# Altium schematic sheet connectors.SchDoc
size 431 x 279 mm; SheetNumber: 2; SheetTotal: 4
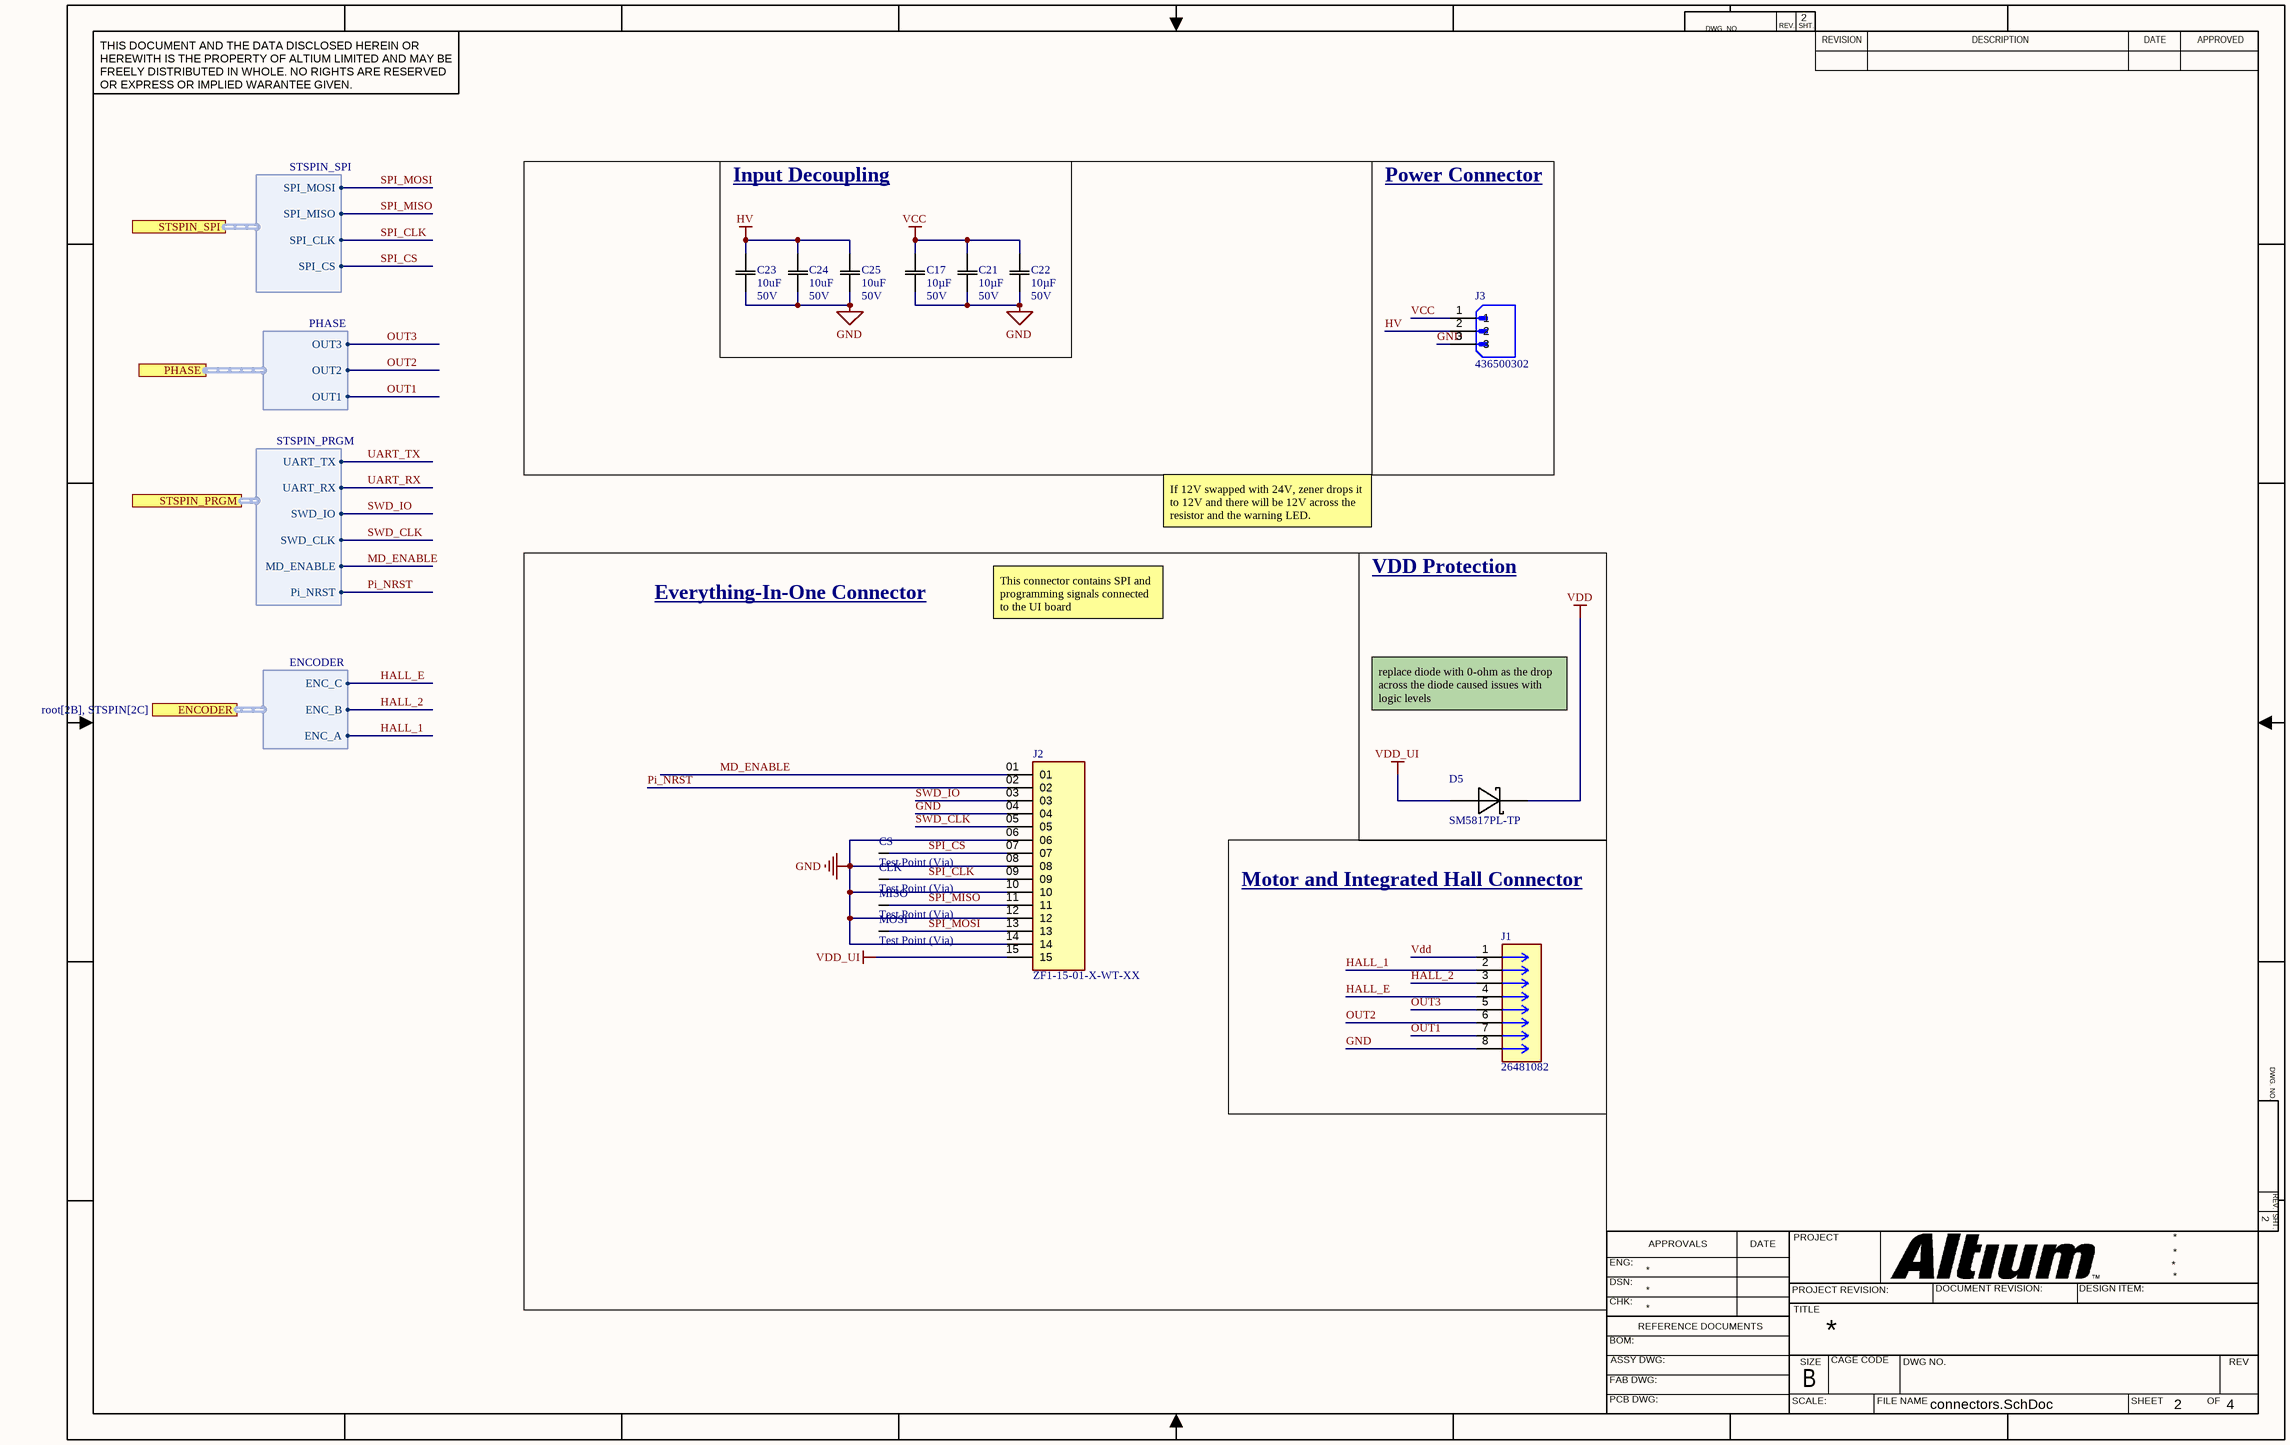
[diagram p0: connectors.SchDoc]

## Parts
C17  value 10µF  Rating: 50V  [0805]  (hidden comment: CAP 10uF 50V)
C21  value 10µF  Rating: 50V  [0805]  (hidden comment: CAP 10uF 50V)
C22  value 10µF  Rating: 50V  [0805]  (hidden comment: CAP 10uF 50V)
C23  Rating: 50V  [0805]  (hidden comment: 10uF)
C24  Rating: 50V  [0805]  (hidden comment: 10uF)
C25  Rating: 50V  [0805]  (hidden comment: 10uF)
CLK  Test Point (Via)  [TP]  (no BOM)
CS  Test Point (Via)  [TP]  (no BOM)
D5  SM5817PL-TP  [SOD-123]
J1  26481082  [CONN_A-41662-B08A_MOL]
J2  ZF1-15-01-X-WT-XX  [SAMTEC_ZF1-15-01-X-WT-XX]
J3  436500302  [MOLEX_436500302]
MISO  Test Point (Via)  [TP]  (no BOM)
MOSI  Test Point (Via)  [TP]  (no BOM)

## Blocks framed on the sheet
Input Decoupling: C17 C21-C25
Power Connector: J3
Everything-In-One Connector: CLK CS J2 MISO MOSI
VDD Protection: D5
Motor and Integrated Hall Connector: J1

## Ports
ENCODER (harness ENCODER, see root[2B], STSPIN[2C]), PHASE (harness PHASE, see root[2B], STSPIN[2D]), STSPIN_PRGM (harness STSPIN_PRGM, see root[2B], STSPIN[2D]), STSPIN_SPI (harness STSPIN_SPI, see root[2B], STSPIN[2E])

## Harnesses
PHASE: OUT3, OUT2, OUT1
ENCODER: ENC_C, ENC_B, ENC_A
STSPIN_SPI: SPI_MOSI, SPI_MISO, SPI_CLK, SPI_CS
STSPIN_PRGM: SWD_IO, SWD_CLK, UART_TX, UART_RX, MD_ENABLE, Pi_NRST

## Nets
GND: C17.1(C1) C21.1(C1) C22.1(C1) C23.1(C1) C24.1(C1) C25.1(C1) J1.8 J2.04 J2.06 J2.08 J2.10 J2.12 J2.14 J3.3
HV: C23.2(C2) C24.2(C2) C25.2(C2) J3.2
VCC: C17.2(C2) C21.2(C2) C22.2(C2) J3.1
Vdd: D5.C(K) J1.1
VDD_UI: D5.A J2.15
HALL_1: J1.2 ; port ENCODER.ENC_A
HALL_2: J1.3 ; port ENCODER.ENC_B
HALL_E: J1.4 ; port ENCODER.ENC_C
MD_ENABLE: J2.01 ; port STSPIN_PRGM.MD_ENABLE
OUT1: J1.7 ; port PHASE.OUT1
OUT2: J1.6 ; port PHASE.OUT2
OUT3: J1.5 ; port PHASE.OUT3
Pi_NRST: J2.02 ; port STSPIN_PRGM.Pi_NRST
SPI_CLK: CLK.1 J2.09 ; port STSPIN_SPI.SPI_CLK
SPI_CS: CS.1 J2.07 ; port STSPIN_SPI.SPI_CS
SPI_MISO: J2.11 MISO.1 ; port STSPIN_SPI.SPI_MISO
SPI_MOSI: J2.13 MOSI.1 ; port STSPIN_SPI.SPI_MOSI
SWD_CLK: J2.05 ; port STSPIN_PRGM.SWD_CLK
SWD_IO: J2.03 ; port STSPIN_PRGM.SWD_IO
UART_RX: port STSPIN_PRGM.UART_RX
UART_TX: port STSPIN_PRGM.UART_TX

## Notes on the sheet
- If 12V swapped with 24V, zener drops it to 12V and there will be 12V across the resistor and the warning LED.
- This connector contains SPI and programming signals connected to the UI board
- replace diode with 0-ohm as the drop across the diode caused issues with logic levels
- DWG. NO.
- REV.
- SHT.
- THIS DOCUMENT AND THE DATA DISCLOSED HEREIN OR HEREWITH IS THE PROPERTY OF ALTIUM LIMITED AND MAY BE FREELY DISTRIBUTED IN WHOLE. NO RIGHTS ARE RESERVED OR EXPRESS OR IMPLIED WARANTEE GIVEN.
- REVISION
- DESCRIPTION
- DATE
- APPROVED
- ENG:
- APPROVALS
- PROJECT
- DSN:
- CHK:
- REFERENCE DOCUMENTS
- PROJECT REVISION:
- TITLE
- DOCUMENT REVISION:
- DESIGN ITEM:
- BOM:
- FAB DWG:
- PCB DWG:
- ASSY DWG:
- SCALE:
- SIZE
- B
- CAGE CODE
- FILE NAME
- DWG NO.
- SHEET
- OF
- REV

## Library data of the parts
C17 C21 C22 = CMP-001-00129-1: Manufacturer Part Number 1: GRM21BR61H106KE43L; Tolerance: 10%; Temperature Coefficient: X5R; Manufacturer Part Number 2: CL32B106KBJNNWE; Part Number: CAP 10uF 50V
C23-C25 = CAP 10uF 50V: Default Symbol for Capacitors; Manufacturer Part Number 1: GRM21BR61H106KE43L; Temperature Coefficient: X5R; Tolerance: 10%; Value: 10uF; Part Number: CAP 10uF 50V; Supplier 1: Digi-Key; Supplier Part Number 1: 490-18663-1-ND; Manufacturer Part Number 2: CL32B106KBJNNWE; Supplier 2: Digi-Key; Supplier Part Number 2: 1276-3388-1-ND
CLK CS MISO MOSI = CMP-024-000001-1: Part Number: Test Point (Via)
D5 = DIODE SCHOTTKY 20V 1A: Diode Schottky 20V 1A Surface Mount SOD-123FL; MF: Micro Commercial Co; ComponentLink1Description: digikey; ComponentLink1URL: https://www.digikey.ca/product-detail/en/on-semiconductor/MBR0540T1G/MBR0540T1GOSCT-ND/917967; Digikey: SM5817PL-TPMSCT-ND; Digikey Link: https://www.digikey.ca/product-detail/en/micro-commercial-co/SM5817PL-TP/SM5817PL-TPMSCT-ND/1793410; MP: SM5817PL-TP; Voltage Rating: 20V; Package: SOD-123; Current Rating: 1A; Part Number: DIODE SCHOTTKY 20V 1A; Supplier URL 1: https://www.digikey.ca/product-detail/en/on-semiconductor/MBR0540T1G/MBR0540T1GOSCT-ND/917967; Pin Count: 2
J1 = CMP-002-00648-2: KK 396 Breakaway Header, Right-Angle, 8 Circuits, Tin (Sn) Plating, 7.0A per contact; Availability: Unavailable; MP: 26481082; Case/Package: None; Component Type: Standard; Source: 26481082.SchLib; Pins: 8; Design Item ID: 26481082; Price: None; Value: *
J2 = CMP-002-00627-3: 15 Position FFC Connector Contacts, Bottom 0.039 (1.00mm) Surface Mount, Right Angle; MP: ZF1-15-01-T-WT-TR; MF: Samtec; Purchase-URL: https://pricing.snapeda.com/search/part/ZF1-15-01-T-WT-TR/?ref=eda; Price: None; Case/Package: None; SnapEDA_Link: https://www.snapeda.com/parts/ZF1-15-01-T-WT-TR/Samtec/view-part/3472733/?ref=snap; Value: *; Availability: Warning; Source: ZF1-15-01-X-WT-XX.SchLib; Design Item ID: ZF1-15-01-X-WT-XX; Check_prices: https://www.snapeda.com/parts/ZF1-15-01-T-WT-TR/Samtec/view-part/3472733/?ref=eda; Component Type: Standard; Pins: 15
J3 = CMP-002-00649-4: CONN HEADER R/A 3POS 3MM; Source: 436500302.SchLib; Value: *; Case/Package: None; Availability: Unavailable; MP: 436500302; Component Type: Standard; Design Item ID: 436500302; Price: None; Pins: 3